# EAGLE schematic Theia (EAGLE 7.7.0)
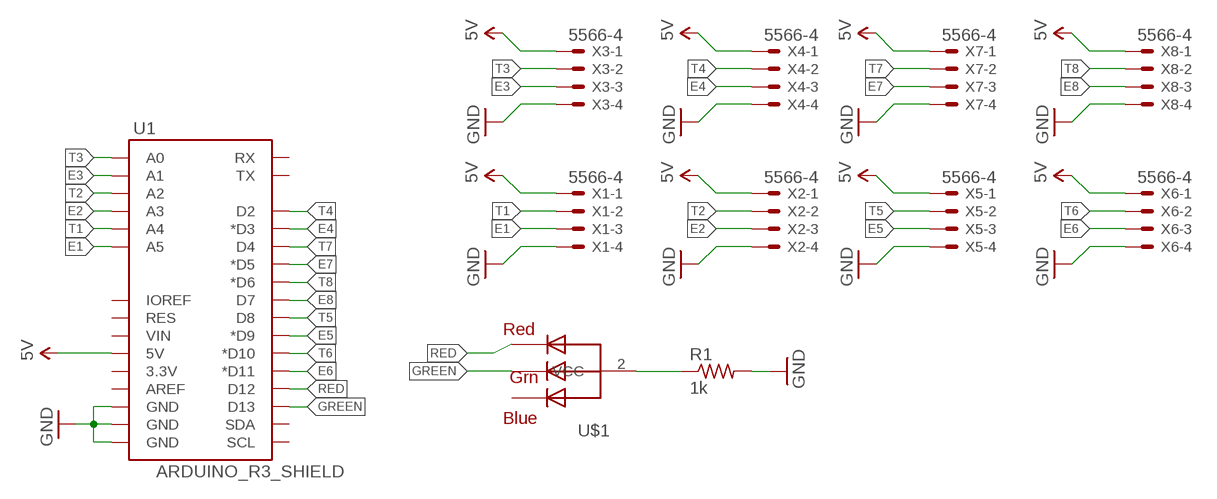
[diagram p0: schematic, sheet 1]

## Parts
R1  1k  R-US_0207/7  [0207/7]
U1  ARDUINO_R3_SHIELD  [UNO_R3_SHIELD]
U$1  RGBLED_CA  [LED5MMRGB]
X1  5566-4  [5566-4]
X2  5566-4  [5566-4]
X3  5566-4  [5566-4]
X4  5566-4  [5566-4]
X5  5566-4  [5566-4]
X6  5566-4  [5566-4]
X7  5566-4  [5566-4]
X8  5566-4  [5566-4]

## Nets
5V: U1.5V X1.1 X2.1 X3.1 X4.1 X5.1 X6.1 X7.1 X8.1
E1: U1.A5 X1.3
E2: U1.A3 X2.3
E3: U1.A1 X3.3
E4: U1.D3(*D3) X4.3
E5: U1.D9(*D9) X5.3
E6: U1.D11(*D11) X6.3
E7: U1.D5(*D5) X7.3
E8: U1.D7 X8.3
GND: R1.2 U1.GND@0(GND) U1.GND@1(GND) U1.GND@2(GND) X1.4 X2.4 X3.4 X4.4 X5.4 X6.4 X7.4 X8.4
GREEN: U1.D13 U$1.3(GREEN)
N$8: R1.1 U$1.2(VCC)
RED: U1.D12 U$1.1(RED)
T1: U1.A4 X1.2
T2: U1.A2 X2.2
T3: U1.A0 X3.2
T4: U1.D2 X4.2
T5: U1.D8 X5.2
T6: U1.D10(*D10) X6.2
T7: U1.D4 X7.2
T8: U1.D6(*D6) X8.2
Unconnected: U1.3.3V U1.AREF U1.IOREF U1.RES U1.RX U1.SCL U1.SDA U1.TX U1.VIN U$1.4(BLUE)

## Library data of the parts
R1 = adafruit:R-US_: RESISTOR, American symbol
U1 = Nathans-Arduinos:ARDUINO_R3_SHIELD: Shield form compatible with the Arduino Uno R3.
U$1 = adafruit:RGBLED_CA: RGB LED, common-anode Staggered pins http://www.ladyada.net/library/pcb/eaglelibrary.html
X1-X8 = con-molex:5566-4: Mini FIT connector 4 pol Source: http://www.molex.com; OC_FARNELL: unknown; OC_NEWARK: unknown

## Net classes
0 default: clearance 0.508 mm